# EAGLE design BlinkyBoard-testcard (EAGLE 6.4)
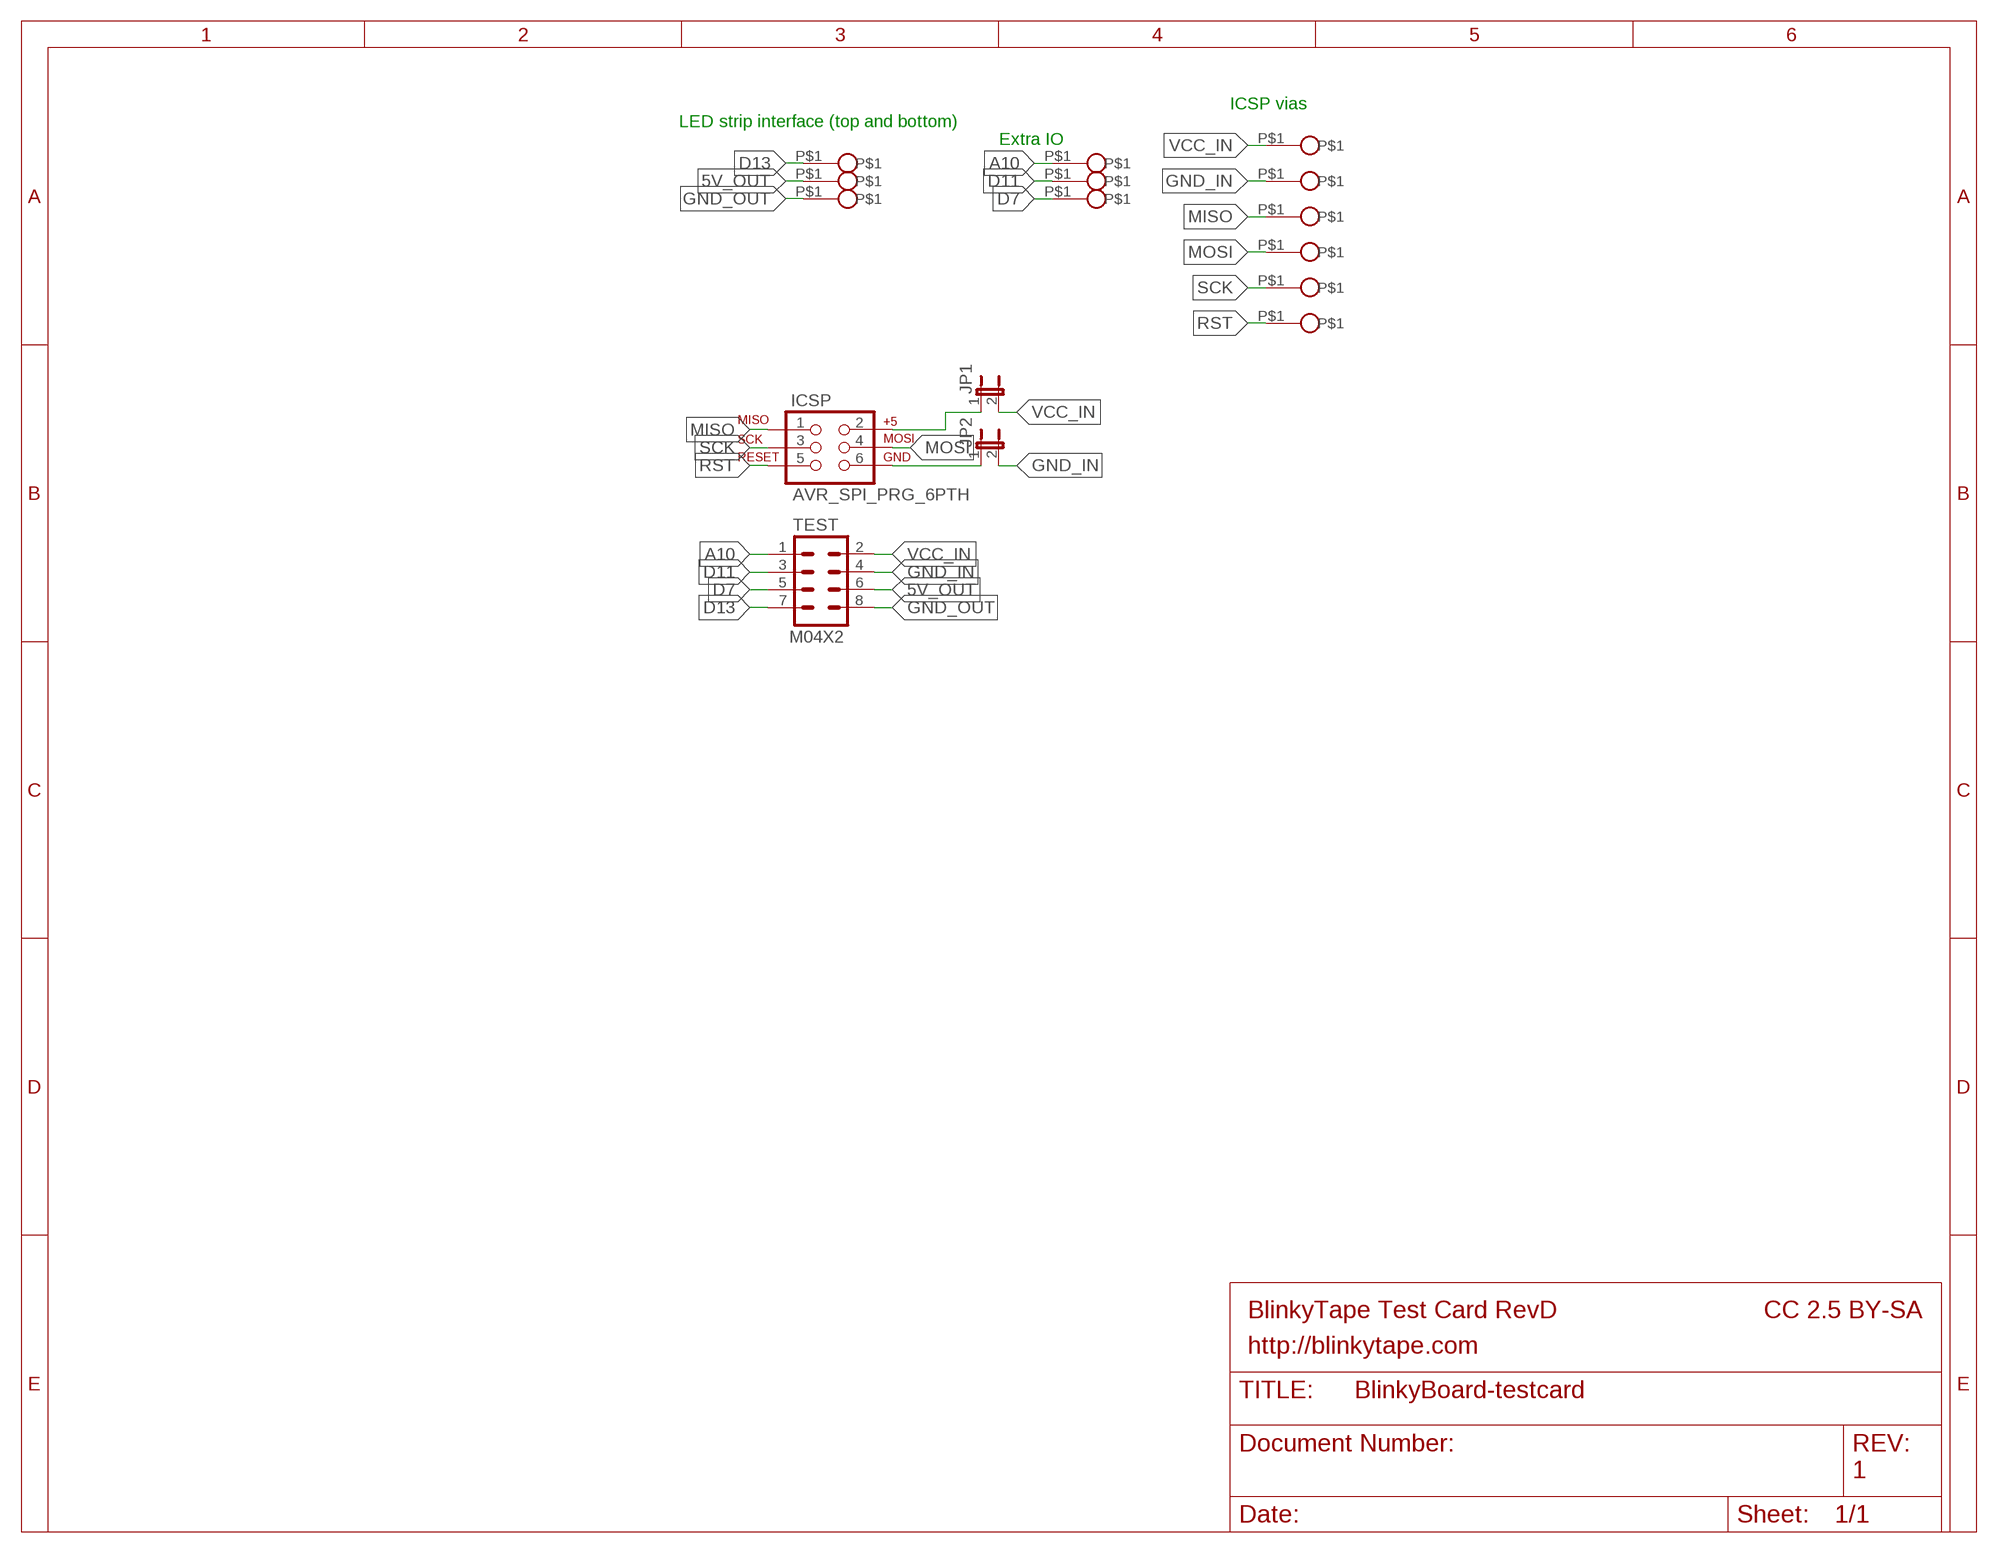
[diagram p0: schematic, sheet 1]

## Parts
ICSP  AVR_SPI_PRG_6PTH  [2X3]
JP1  JUMPER-2PTH  [1X02]
JP2  JUMPER-2PTH  [1X02]
TEST  M04X2  [2X4]
U$9  POGO_PIN  [POGO_PIN_1MM]
U$16  POGO_PIN  [POGO_PIN_1MM]
U$17  POGO_PINOBLONG  [POGO_PIN_1MM_OBLONG]
U$18  POGO_PINOBLONG  [POGO_PIN_1MM_OBLONG]
U$19  POGO_PINOBLONG  [POGO_PIN_1MM_OBLONG]
U$20  POGO_PINOBLONG  [POGO_PIN_1MM_OBLONG]
U$22  POGO_PIN  [POGO_PIN_1MM]
U$23  POGO_PIN  [POGO_PIN_1MM]
U$24  POGO_PIN  [POGO_PIN_1MM]
U$26  POGO_PIN  [POGO_PIN_1MM]
U$27  POGO_PIN  [POGO_PIN_1MM]
U$28  POGO_PIN  [POGO_PIN_1MM]

## Nets
5V_OUT: TEST.6 U$27.P$1
A10: TEST.1 U$22.P$1
D7: TEST.5 U$24.P$1
D11: TEST.3 U$23.P$1
D13: TEST.7 U$26.P$1
GND_IN: JP2.2 TEST.4 U$16.P$1
GND_OUT: TEST.8 U$28.P$1
MISO: ICSP.1 U$17.P$1
MOSI: ICSP.4 U$18.P$1
N$2: ICSP.2 JP1.1
N$11: ICSP.6 JP2.1
RST: ICSP.5 U$20.P$1
SCK: ICSP.3 U$19.P$1
VCC_IN: JP1.2 TEST.2 U$9.P$1

## Notes on the sheet
- ICSP vias
- LED strip interface (top and bottom)
- Extra IO
- BlinkyTape Test Card RevD | CC 2.5 BY-SA
- http://blinkytape.com
- 1

## Library data of the parts
ICSP = SparkFun-Connectors:AVR_SPI_PRG_6: AVR ISP 6 Pin This is the reduced ISP connector for AVR programming. Common on Arduino. This footprint will take up less PCB space and can be used with a 10-pin to 6-pin adapter such as SKU: BOB-08508
JP1 JP2 = SparkFun-Passives:JUMPER-2: Jumper Basic 0.1" spaced jumper. Use with breakaway headers.
TEST = SparkFun-Connectors:M04X2: .1" header, two rows of four.
U$9 U$16-U$20 U$22-U$24 U$26-U$28 = blinkiverse:POGO_PIN

## Board
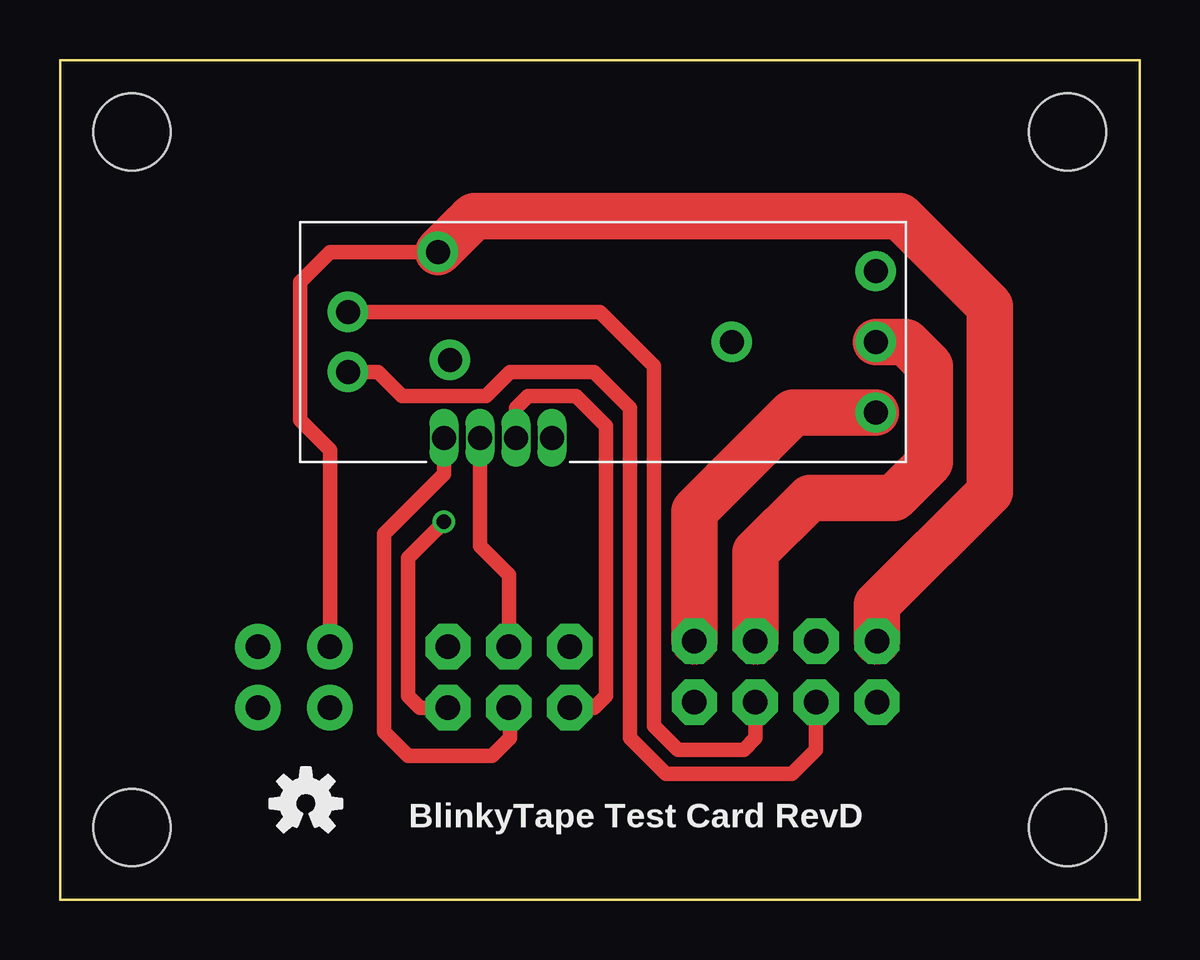
[diagram p1: board, top side]
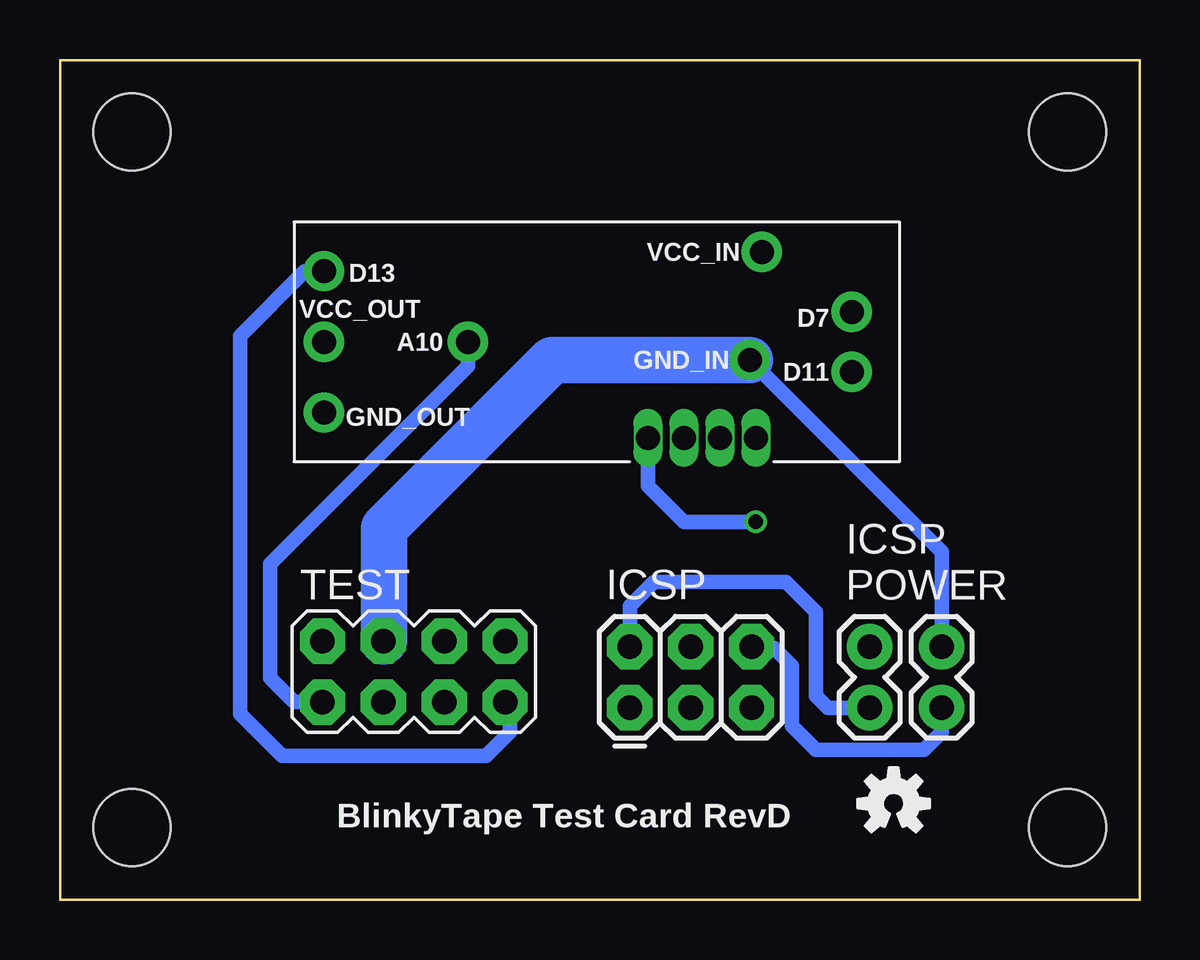
[diagram p2: board, bottom side, seen from below]

Size 45 x 35 mm. Coordinates in mm from the lower left corner, seen from the top.
Outline: 0,0 0,35 45,35 45,0 0,0
Copper layers (1*16): Top 0.0356mm / dielectric 1.5011mm / Bottom 0.0356mm
Design rules "BlinkyTape-testjig": minimum track width 0.25mm, minimum drill 0.35mm, track to track 0.2mm, track to pad 0.2mm, pad to pad 0.2mm, via to via 0.2mm, smd to smd 0.2mm, copper to edge 15mil, drill to drill 0.25mm, minimum pad ring 0.1mm, minimum via ring 7mil, stop-mask expansion 2mil, vias tented up to drill 0.35mm, thermal gap 10mil
Holes 3.2 mm at 3,3 3,32 42,32 42,3

### Footprints (pad centres in the part's own frame; a part is rotated, then mirrored left to right if it is on the bottom)
2X3 = drill 1.016 pad 1.88 octagon: 1 0,0; 2 0,2.54; 3 2.54,0; 4 2.54,2.54; 5 5.08,0; 6 5.08,2.54
1X02 = drill 1.016 pad 1.88: 1 0,0; 2 2.54,0
2X4 = drill 1.016 pad 1.88 octagon: 1 -3.81,-1.27; 2 -3.81,1.27; 3 -1.27,-1.27; 4 -1.27,1.27; 5 1.27,-1.27; 6 1.27,1.27; 7 3.81,-1.27; 8 3.81,1.27
POGO_PIN_1MM = drill 1 pad 1.676: P$1 0,0
POGO_PIN_1MM_OBLONG = drill 1 pad 1.05 long: P$1 0,0

### Placement (x,y rotation side)
ICSP  21.25,8 0 bottom
JP1  11.25,8 90 bottom
JP2  8.25,8 90 bottom
TEST  30.25,9.5 0 bottom
U$3  [OSHW-LOGO-S]  10.25,4 0 top
U$9  15.75,27 0 top
U$15  [OSHW-LOGO-S]  10.25,4 0 bottom
U$16  16.25,22.5 0 top
U$17  19,19.25 0 top
U$18  17.5,19.25 0 top
U$19  16,19.25 0 top
U$20  20.5,19.25 0 top
U$22  28,23.25 0 top
U$23  12,22 0 top
U$24  12,24.5 0 top
U$26  34,26.2 0 top
U$27  34,23.25 0 top
U$28  34,20.3 0 top

### Tracks (layer width: path | path; a pad name or v marks a point on that pad's centre or on a via)
5V_OUT
  Top 1.93: TEST.6 28.98,14.48 31.25,16.75 34.75,16.75 36.25,18.25 36.25,22.25 35.25,23.25 U$27.P$1
A10
  Bottom 0.61: U$22.P$1 28,22.25 36.25,14 36.25,9.25 35.25,8.25 34.08,8.25 TEST.1
D7
  Top 0.61: TEST.5 28.98,6.73 28.5,6.25 25.75,6.25 24.75,7.25 24.75,22.25 22.5,24.5 U$24.P$1
D11
  Top 0.61: U$23.P$1 13.25,22 14.25,21 17.75,21 18.75,22 22.25,22 23.75,20.5 23.75,6.75 25.25,5.25 30.5,5.25 31.5,6.25 31.5,8.21 TEST.3
D13
  Bottom 0.61: U$26.P$1 34.8,26.2 37.5,23.5 37.5,7.75 35.75,6 27.25,6 26.25,7 26.25,8.04 TEST.7
GND_IN
  Bottom 0.61: U$16.P$1 8.25,14.5 JP2.2
  Bottom 1.93: U$16.P$1 24.5,22.5 31.5,15.5 31.5,10.79 TEST.4
GND_OUT
  Top 1.93: TEST.8 26.44,16.19 30.55,20.3 U$28.P$1
MISO
  Top 0.61: U$17.P$1 19,20.5 19.5,21 21.5,21 22.75,19.75 22.75,8.5 22.25,8 ICSP.1
MOSI
  Top 0.61: U$18.P$1 17.5,14.75 18.71,13.54 ICSP.4
N$2
  Bottom 0.61: JP1.1 13,8 13.5,8.5 13.5,12 14.75,13.25 20.25,13.25 21.25,12.25 ICSP.2
N$11
  Bottom 0.61: JP2.1 8.25,7 9,6.25 13.5,6.25 14.5,7.25 14.5,9.75 15.25,10.5 16.13,10.5 ICSP.6
RST  (via drill 0.6)
  Top 0.61: ICSP.5 15,8 14.5,8.5 14.5,14.25 v16,15.75
  Bottom 0.61: v16,15.75 19,15.75 20.5,17.25 U$20.P$1
SCK
  Top 0.61: U$19.P$1 16,17.75 13.5,15.25 13.5,7 14.5,6 18,6 18.75,6.75 18.75,7.96 ICSP.3
VCC_IN
  Top 0.61: U$9.P$1 11.25,27 10,25.75 10,20 11.25,18.75 JP1.2
  Top 1.93: TEST.2 34.06,12.31 38.75,17 38.75,24.75 35,28.5 17.25,28.5 U$9.P$1

### Text on the board
tNames: BlinkyTape Test Card RevD
bNames: VCC_IN | D13 | D7 | VCC_OUT | A10 | D11 | GND_IN | GND_OUT | ICSP / POWER | BlinkyTape Test Card RevD